# Altium schematic sheet 盛群杯.SCHDOC
size A4
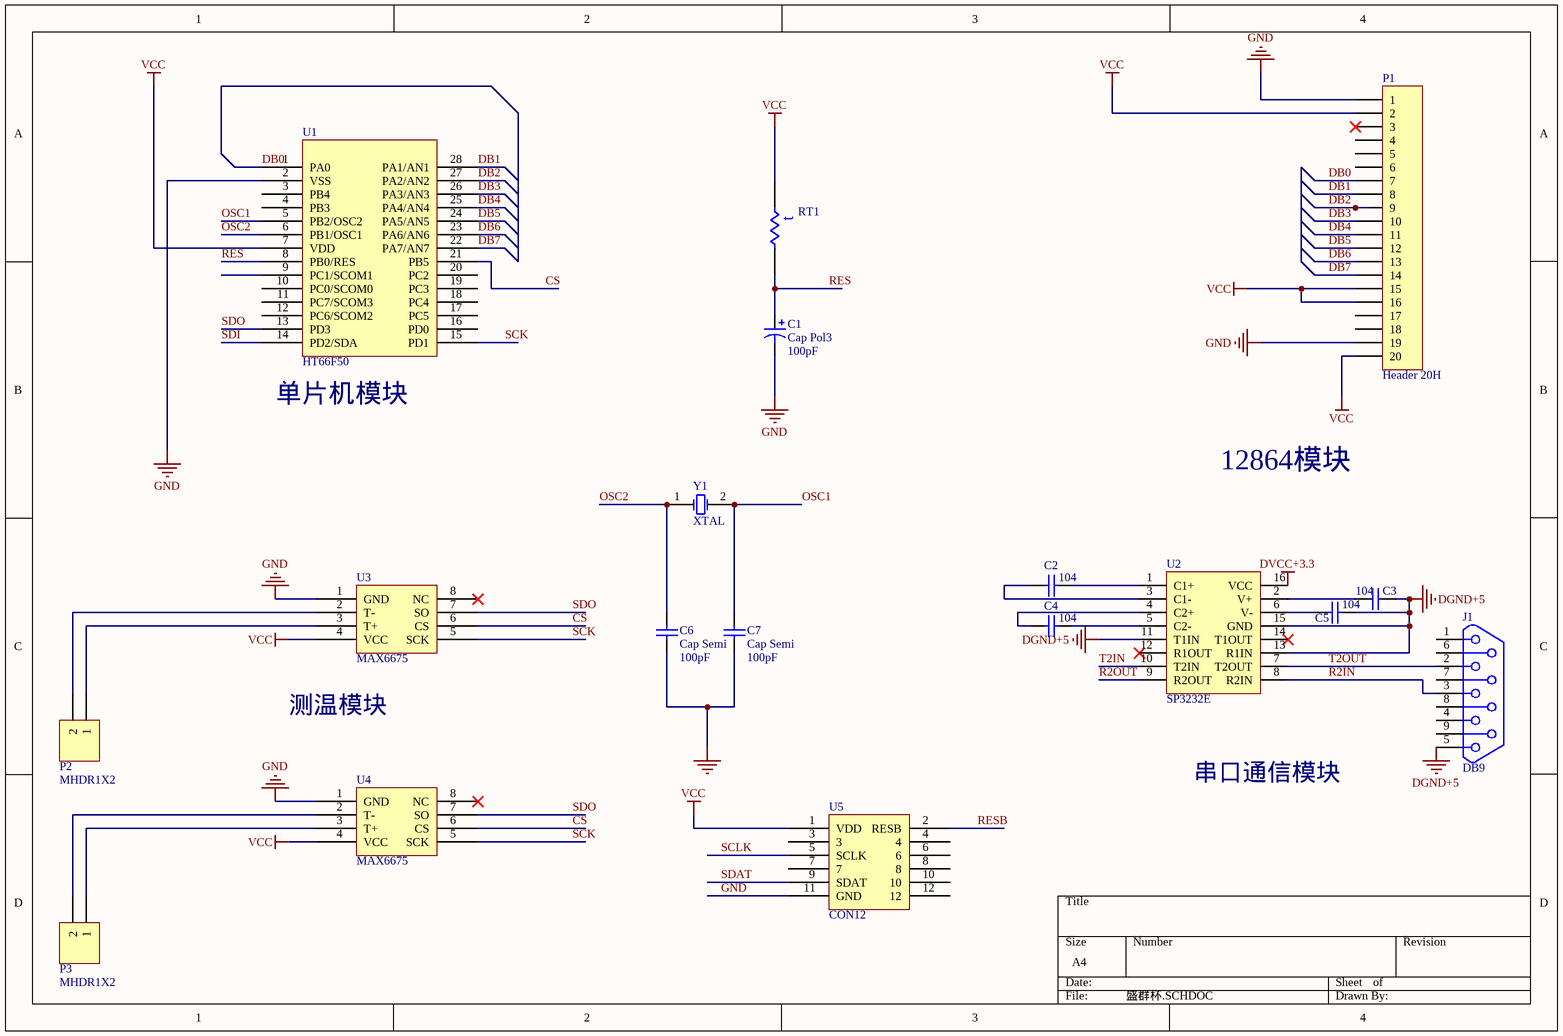
[diagram p0: 盛群杯.SCHDOC]

## Parts
C1  Cap Pol3  value 100pF  [C0805]
C2  value 104  [0805]  (hidden comment: Cap)
C3  value 104  [0805]  (hidden comment: Cap)
C4  value 104  [0805]  (hidden comment: Cap)
C5  value 104  [0805]  (hidden comment: Cap)
C6  Cap Semi  value 100pF  [1608[0603]]
C7  Cap Semi  value 100pF  [1608[0603]]
J1  DB9  [DB_9]
P1  Header 20H  [HDR1X20]
P2  MHDR1X2  [PCBComponent_1]
P3  MHDR1X2  [PCBComponent_1]
RT1  (no value)  [6-0805]
U1  HT66F50
U2  SP3232E
U3  MAX6675
U4  MAX6675
U5  CON12  [MHDR2X6]
Y1  XTAL  [R38]

## Nets
DGND+5: C3.2 C5.2 J1.5 U2.11(T1IN) U2.13(R1IN) U2.15(GND)
DVCC+3.3: U2.16(VCC)
GND: C1.2 C6.2 C7.2 P1.1 P1.19 U1.2(VSS) U3.1(GND) U4.1(GND) U5.11(GND)
VCC: P1.2 P1.15 P1.16 P1.20 RT1.1 U1.7(VDD) U3.4(VCC) U4.4(VCC) U5.1(VDD)
CS: U1.21(PB5) U3.6(CS) U4.6(CS)
DB0: P1.7 U1.1(PA0)
DB1: P1.8 U1.28(PA1/AN1)
DB2: P1.9 U1.27(PA2/AN2)
DB3: P1.10 U1.26(PA3/AN3)
DB4: P1.11 U1.25(PA4/AN4)
DB5: P1.12 U1.24(PA5/AN5)
DB6: P1.13 U1.23(PA6/AN6)
DB7: P1.14 U1.22(PA7/AN7)
OSC1: C7.1 U1.5(PB2/OSC2) Y1.2(OSC2)
OSC2: C6.1 U1.6(PB1/OSC1) Y1.1(OSC1)
R2IN: J1.3 U2.8(R2IN)
R2OUT: U2.9(R2OUT)
RES: C1.1 RT1.2 U1.8(PB0/RES)
RESB: U5.2(RESB)
SCK: U1.15(PD1) U3.5(SCK) U4.5(SCK)
SCLK: U5.5(SCLK)
SDAT: U5.9(SDAT)
SDI: U1.14(PD2/SDA)
SDO: U1.13(PD3) U3.7(SO) U4.7(SO)
T2IN: U2.10(T2IN)
T2OUT: J1.2 U2.7(T2OUT)
NetC2_1: C2.1 U2.3(C1-)
NetC2_2: C2.2 U2.1(C1+)
NetC3_1: C3.1 U2.2(V+)
NetC4_1: C4.1 U2.4(C2+)
NetC4_2: C4.2 U2.5(C2-)
NetC5_1: C5.1 U2.6(V-)
NetP2_1: P2.1 U3.3(T+)
NetP2_2: P2.2 U3.2(T-)
NetP3_1: P3.1 U4.3(T+)
NetP3_2: P3.2 U4.2(T-)

Not connected (* = marked no-connect by the designer): J1 1 4 6 7 8 9; P1 3* 4 5 6 17 18; U1 3(PB4) 4(PB3) 9(PC1/SCOM1) 10(PC0/SCOM0) 11(PC7/SCOM3) 12(PC6/SCOM2) 16(PD0) 17(PC5) 18(PC4) 19(PC3) 20(PC2); U2 12(R1OUT)* 14(T1OUT)*; U3 8(NC)*; U4 8(NC)*; U5 3 4 6 7 8 10 12

## Notes on the sheet
- (near U1) 单片机模块
- 12864模块
- 测温模块
- 串口通信模块
- (in symbol Res Thermal) t

## Library data of the parts
C1 = Cap Pol3: Polarized Capacitor (Surface Mount); Published: 8-Jun-2000; LatestRevisionDate: 17-Jul-2002; LatestRevisionNote: Re-released for DXP Platform.; PackageReference: C0805; Publisher: Altium Limited
C2-C5 = Cap: Capacitor; Published: 8-Jun-2000; LatestRevisionDate: 17-Jul-2002; LatestRevisionNote: Re-released for DXP Platform.; PackageReference: RAD-0.3; Publisher: Altium Limited
C6 C7 = Cap Semi: Capacitor (Semiconductor SIM Model); Published: 8-Jun-2000; LatestRevisionDate: 17-Jul-2002; LatestRevisionNote: Re-released for DXP Platform.; PackageReference: C1206; Publisher: Altium Limited
P1 = Header 20H: Header, 20-Pin, Right Angle; LatestRevisionDate: 17-Jul-2002; LatestRevisionNote: Re-released for DXP Platform.; Publisher: Altium Limited
P2 P3 = MHDR1X2: Header, 2-Pin; LatestRevisionDate: 17-Jul-2002; LatestRevisionNote: Re-released for DXP Platform.; Publisher: Altium Limited
RT1 = Res Thermal: Thermistor; Published: 24-Mar-1999; LatestRevisionDate: 04-Mar-2005; LatestRevisionNote: PCB Footprint replaced.; PackageReference: 6-0805; Publisher: Altium Limited
Y1 = XTAL: Crystal Oscillator; Published: 8-Jun-2000; LatestRevisionDate: 17-Jul-2002; LatestRevisionNote: Re-released for DXP Platform.; PackageReference: R38; Publisher: Altium Limited